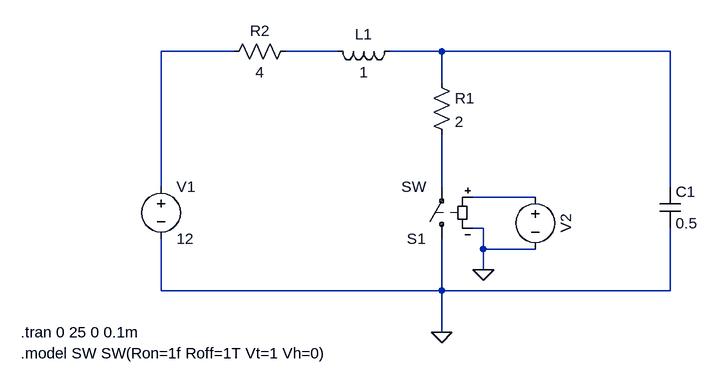
[diagram p0: schematic LTSpice PR 12 no 1.asc]
LTSpice PR 12 no 1.asc, the LTspice schematic file:
Version 4
SHEET 1 1072 680
WIRE 352 -32 240 -32
WIRE 512 -32 432 -32
WIRE 672 -32 592 -32
WIRE 1024 -32 672 -32
WIRE 672 16 672 -32
WIRE 240 176 240 -32
WIRE 672 176 672 96
WIRE 1024 176 1024 -32
WIRE 816 192 720 192
WIRE 736 240 720 240
WIRE 736 272 736 240
WIRE 816 272 736 272
WIRE 736 304 736 272
WIRE 240 336 240 256
WIRE 672 336 672 256
WIRE 672 336 240 336
WIRE 1024 336 1024 240
WIRE 1024 336 672 336
WIRE 672 400 672 336
FLAG 736 304 0
FLAG 672 400 0
SYMBOL sw 672 272 R180
SYMATTR InstName S1
SYMBOL voltage 816 176 R0
WINDOW 0 32 56 VTop 2
WINDOW 3 -32 56 Invisible 2
WINDOW 123 0 0 Left 0
WINDOW 39 0 0 Left 0
SYMATTR InstName V2
SYMATTR Value PULSE(2 0 10 1f 1f 200)
SYMBOL res 656 0 R0
SYMATTR InstName R1
SYMATTR Value 2
SYMBOL cap 1008 176 R0
SYMATTR InstName C1
SYMATTR Value 0.5
SYMBOL voltage 240 160 R0
WINDOW 123 0 0 Left 0
WINDOW 39 0 0 Left 0
SYMATTR InstName V1
SYMATTR Value 12
SYMBOL ind 608 -48 R90
WINDOW 0 5 56 VBottom 2
WINDOW 3 32 56 VTop 2
SYMATTR InstName L1
SYMATTR Value 1
SYMBOL res 448 -48 R90
WINDOW 0 0 56 VBottom 2
WINDOW 3 32 56 VTop 2
SYMATTR InstName R2
SYMATTR Value 4
TEXT 24 400 Left 2 !.tran 0 25 0 0.1m
TEXT 24 432 Left 2 !.model SW SW(Ron=1f Roff=1T Vt=1 Vh=0)

The netlist it stands for:
* LTSpice PR 12 no 1.asc
S1 0 N004 N005 0 SW
V2 N005 0 PULSE(2 0 10 1f 1f 200)
R1 N003 N004 2
C1 N003 0 0.5
V1 N001 0 12
L1 N003 N002 1
R2 N002 N001 4
.tran 0 25 0 0.1m
.model SW SW(Ron=1f Roff=1T Vt=1 Vh=0)
.backanno
.end